# EAGLE design Constant Current Load (EAGLE 6.5.0)
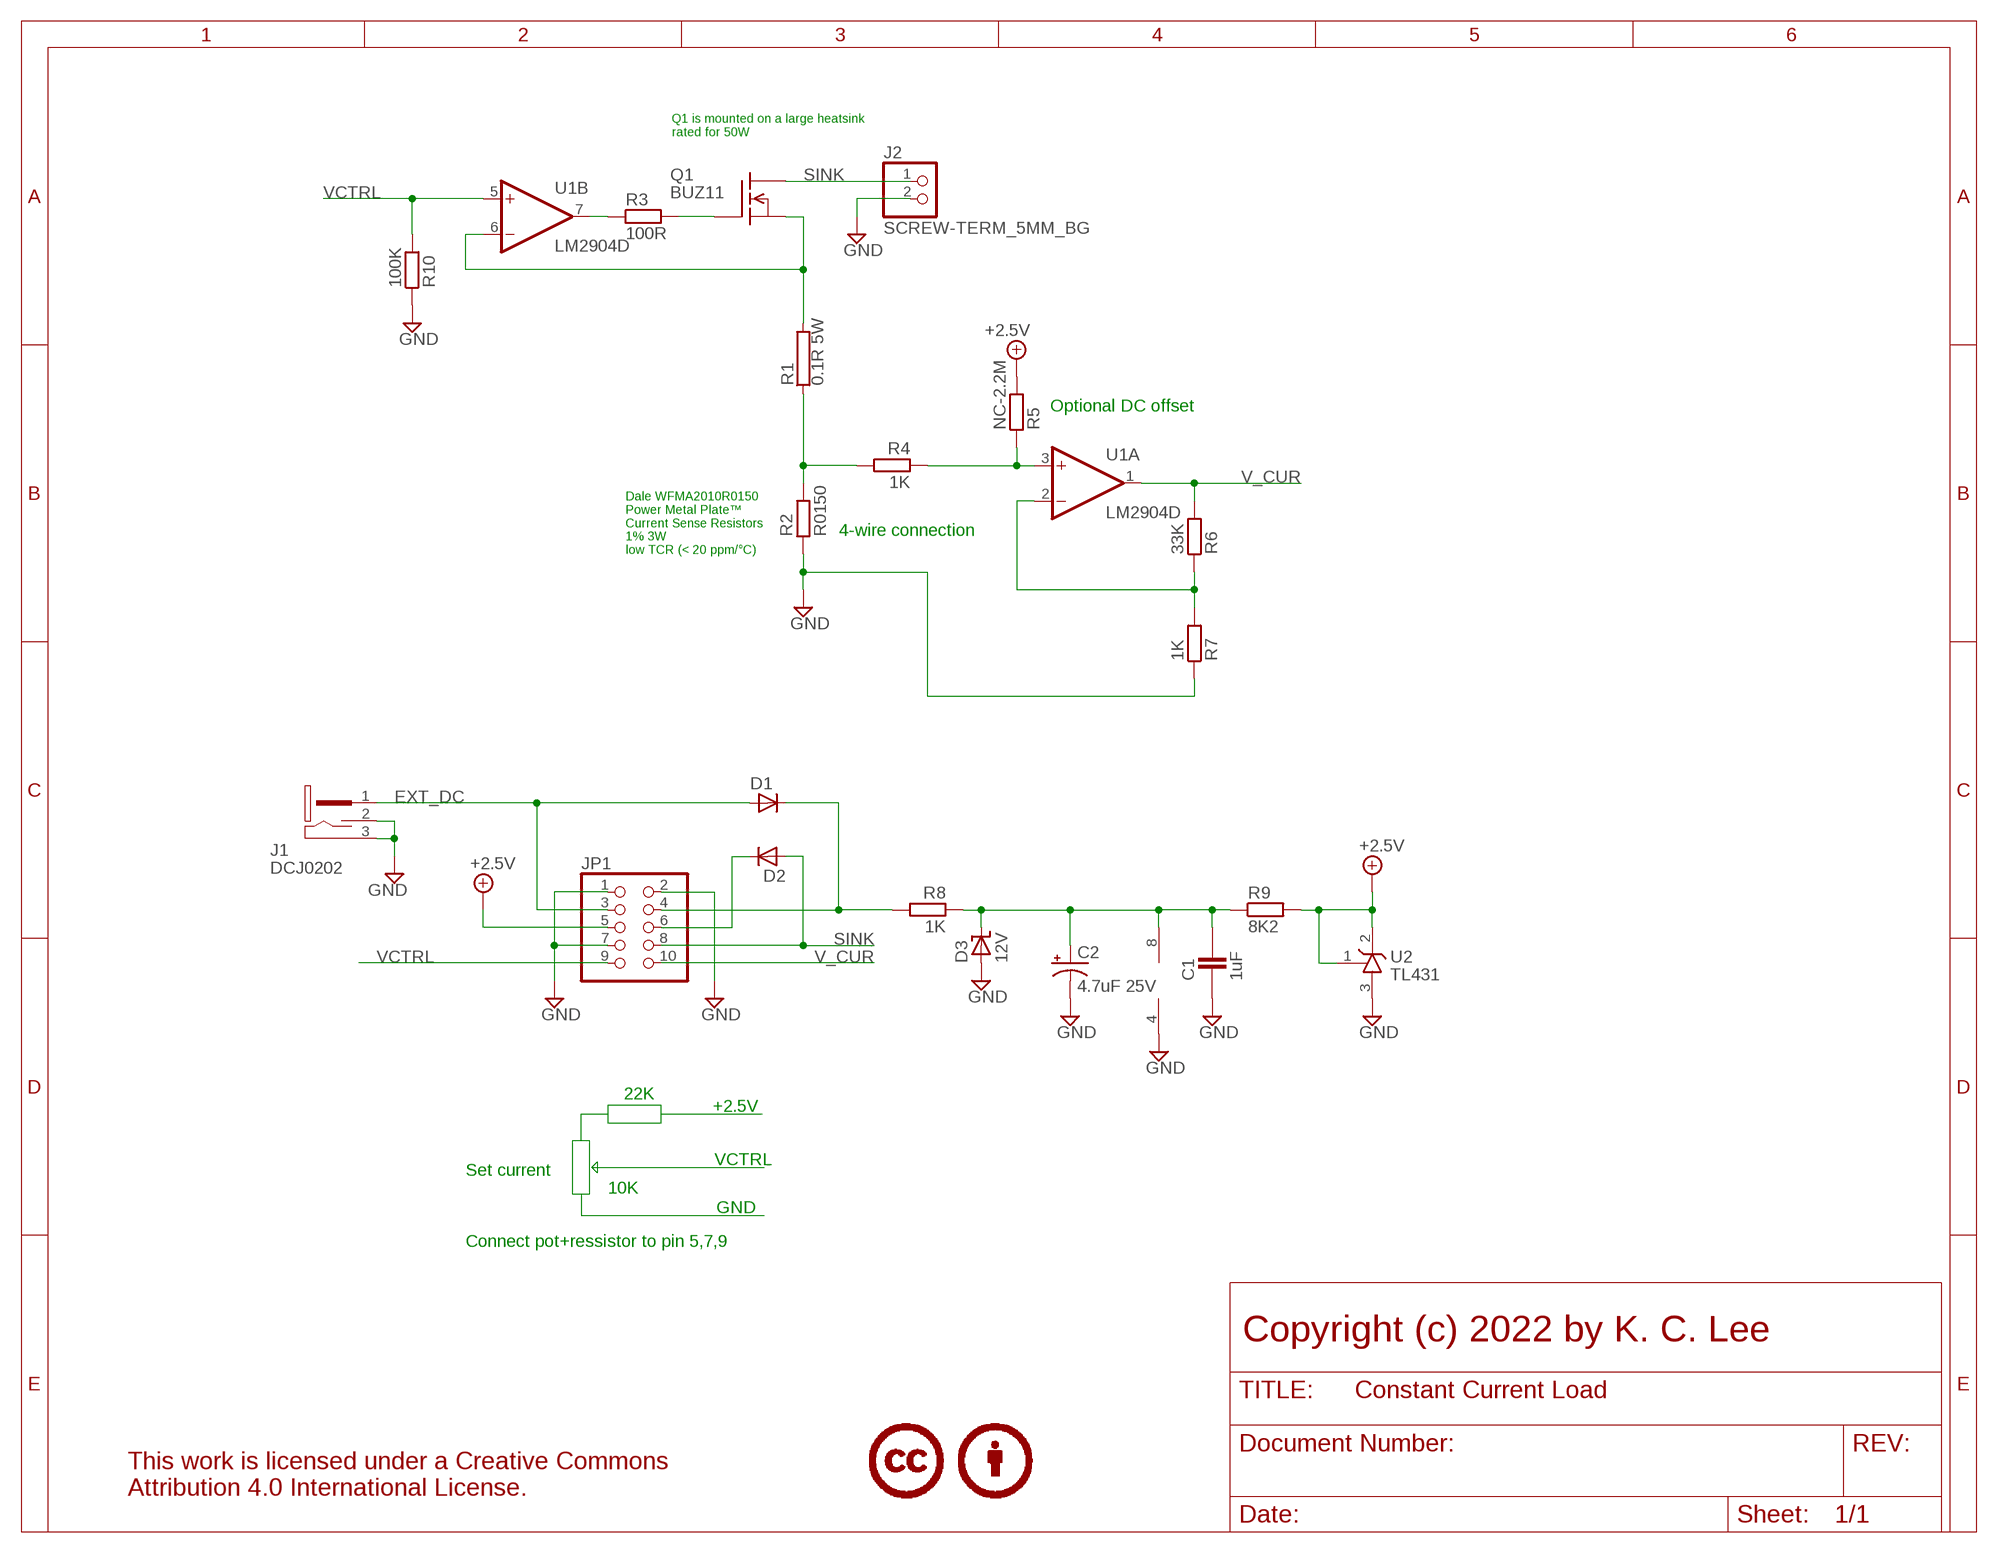
[diagram p0: schematic, sheet 1]

## Parts
C1  1uF  CAPACITOR_0603  [CAPC1608X92N]
C2  4.7uF 25V  CPOL-USE5-6  [E5-6]
D1  DIODE_SOT-23  [SOT95P280X135-3N]
D2  DIODE_SOT-23  [SOT95P280X135-3N]
D3  12V  ZENER_SOT-23  [SOT95P280X135-3N]
J1  DCJ0202  [DCJ0202-SLOTTED]
J2  SCREW-TERM_5MM_BG  [1X02-5MM-BG]
JP1  PINHD-2X5_2.54-W/PLUG  [2X05-W_PLUG]
LICENSE1  CC-BY50%  [CC-BY-50]
Q1  BUZ11  [TO220]
R1  0.1R 5W  RHPS923  [HPS923]
R2  R0150  RESISTOR_2010  [RESC5025X70N]
R3  100R  RESISTOR_0805  [RESC2012X70N]
R4  1K  RESISTOR_0603  [RESC1608X55N]
R5  NC-2.2M  RESISTOR_0603  [RESC1608X55N]
R6  33K  RESISTOR_0603  [RESC1608X55N]
R7  1K  RESISTOR_0603  [RESC1608X55N]
R8  1K  RESISTOR_0805  [RESC2012X70N]
R9  8K2  RESISTOR_0805  [RESC2012X70N]
R10  100K  RESISTOR_0603  [RESC1608X55N]
U1  LM2904D  LM358D  [SO08]
U2  TL431  TL_431DBZ  [SOT95P280X135-3N]

## Nets
+2.5V: JP1.5 R5.2 R9.2 U2.1(R) U2.2(C)
EXT_DC: D1.1(A) J1.1 JP1.3
GND: C1.1 C2.- D3.1(A) J1.2 J1.3 J2.2 JP1.1 JP1.2 JP1.7 R2.1 R7.1 R10.1 U1.4(P:V-) U2.3(A)
N$1: Q1.3(S) R1.2 U1.6(B:-IN)
N$2: C1.2 C2.+ D3.3(K) R8.1 R9.1 U1.8(P:V+)
N$3: D2.3(K) JP1.6
N$4: Q1.1(G) R3.2
N$7: R3.1 U1.7(B:OUT)
N$8: R1.1 R2.2 R4.2
N$9: R4.1 R5.1 U1.3(A:+IN)
N$12: R6.1 R7.2 U1.2(A:-IN)
SINK: D2.1(A) J2.1 JP1.8 Q1.2(D)
V_BUS: D1.3(K) JP1.4 R8.2
V_CUR: JP1.10 R6.2 U1.1(A:OUT)
VCTRL: JP1.9 R10.2 U1.5(B:+IN)

## Notes on the sheet
- Q1 is mounted on a large heatsink
  rated for 50W
- Optional DC offset
- 4-wire connection
- Dale WFMA2010R0150 
  Power Metal Plate™ 
  Current Sense Resistors
  1% 3W 
  low TCR (< 20 ppm/°C)
- 22K
- +2.5V
- VCTRL
- Set current
- 10K
- GND
- Connect pot+ressistor to pin 5,7,9
- Copyright (c) 2022 by K. C. Lee

## Library data of the parts
C1 = ipc-7351-capacitor:CAPACITOR_
C2 = resistor:CPOL-US: POLARIZED CAPACITOR, American symbol
D1 D2 = ipc-7351-diode:DIODE_
D3 = ipc-7351-diode:ZENER_
J1 = Misc Conn:DCJ0202: DC POWER JACK Source: DCJ0202.pdf Pin = CUI Inc. PJ-102A with formed pins
J2 = Misc Conn:SCREW-TERM: Screw Terminal: 3.5mm: On-Shore Technology OSTTE0201x4
JP1 = Misc Conn:PINHD-2X5: PIN HEADER
LICENSE1 = Misc logo:CC-BY
Q1 = transistor-fet:BUZ11: N-Channel Enhancement MOSFET 50V; 30A; 0,040Ohm
R1 = resistor-power:R: Power Resitor; OC_FARNELL: unknown; OC_NEWARK: unknown
R2-R10 = ipc-7351-resistor:RESISTOR_
U1 = linear:LM358: OP AMP also LM158; LM258; LM2904 Source: http://cache.national.com/ds/LM/LM158.pdf
U2 = Misc Analog:TL_431: Voltage Reference 1.24V TI TL431, ST3431

## Board
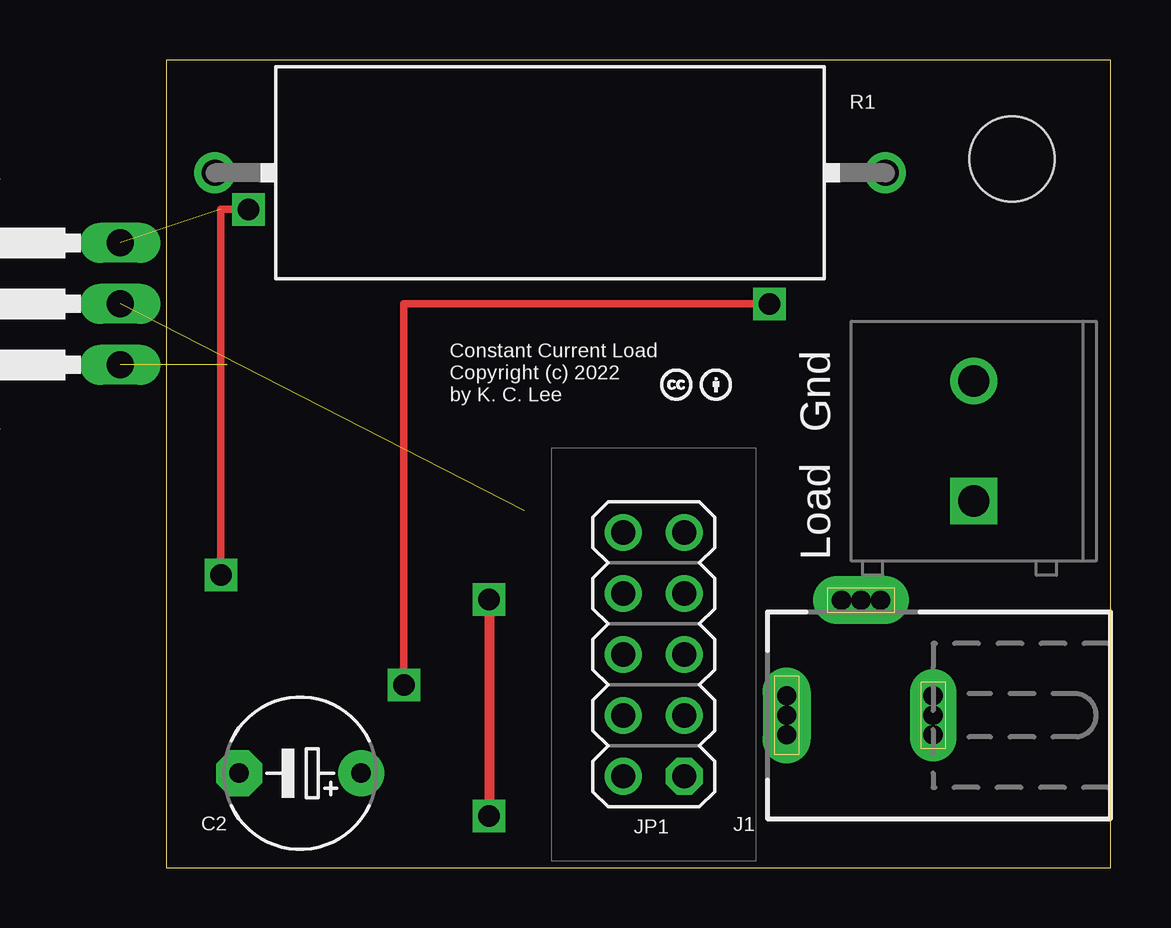
[diagram p1: board, top side]
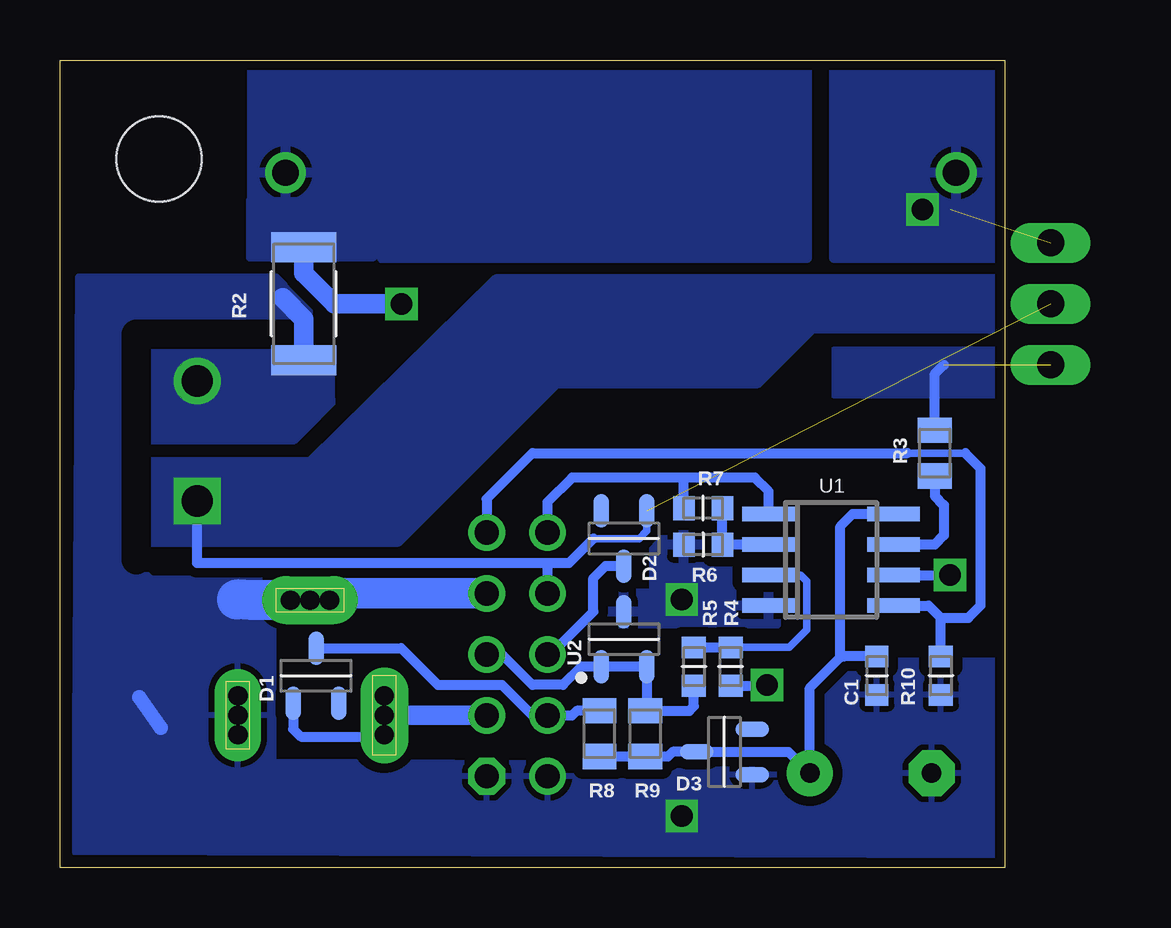
[diagram p2: board, bottom side, seen from below]

Size 39.37 x 33.66 mm. Coordinates in mm from the lower left corner, seen from the top.
Outline: 0,0 39.37,0 39.37,33.66 0,33.66 0,0
Copper layers (1*16): Top 0.035mm / dielectric 1.5mm / Bottom 0.035mm
Design rules "Elecrow 2-layer eagle rule": minimum track width 6mil, minimum drill 12mil, track to track 6mil, track to pad 6mil, pad to pad 6mil, via to via 6mil, smd to smd 0mil, copper to edge 10mil, drill to drill 10mil, minimum pad ring 10mil, minimum via ring 6mil, stop-mask expansion 2mil, vias tented up to drill 100mil, thermal gap 10mil
Holes 3.56 mm at 35.24,29.53
bRestrict: 6 lines

### Footprints (pad centres in the part's own frame; a part is rotated, then mirrored left to right if it is on the bottom)
CAPC1608X92N = smd 0.9 x 0.95: 1 -0.8,0; 2 0.8,0
E5-6 = drill 0.813 pad 1.905: + -2.54,0 | drill 0.813 pad 1.905 octagon: - 2.54,0
SOT95P280X135-3N = smd 1.4 x 0.65: 1 -1.15,0.95; 2 -1.15,-0.95; 3 1.15,0
DCJ0202-SLOTTED = drill 0.8 pad 2 long: 1 0,3.1; 2 4.8,0 | drill 0.8: 1A -0.813,3.1; 1B 0.813,3.1; 2A 4.8,-0.813; 2B 4.8,0.813; 3A -0.813,-3; 3B 0.813,-3 | drill 0.8 pad 1.93 long: 3 0,-3
1X02-5MM-BG = drill 1.3 square: 1 -2.5,0 | drill 1.3: 2 2.5,0
2X05-W_PLUG = drill 1.016 octagon: 1 -5.08,-1.27 | drill 1.016: 2 -5.08,1.27; 3 -2.54,-1.27; 4 -2.54,1.27; 5 0,-1.27; 6 0,1.27; 7 2.54,-1.27; 8 2.54,1.27; 9 5.08,-1.27; 10 5.08,1.27
TO220 = drill 1.118 long: 1 -2.54,-6.35; 2 0,-6.35; 3 2.54,-6.35 | hole 3.302: 0,11.176
HPS923 = drill 1.1 pad 1.7: 1 -13.97,0; 2 13.97,0
RESC5025X70N = smd 1.25 x 2.7: 1 -2.35,0; 2 2.35,0
RESC2012X70N = smd 1.05 x 1.4: 1 -0.95,0; 2 0.95,0
RESC1608X55N = smd 0.9 x 1: 1 -0.8,0; 2 0.8,0
SO08 = smd 0.6 x 2.2: 1 -1.905,-2.6; 2 -0.635,-2.6; 3 0.635,-2.6; 4 1.905,-2.6; 5 1.905,2.6; 6 0.635,2.6; 7 -0.635,2.6; 8 -1.905,2.6

### Placement (x,y rotation side)
C1  5.33,8 90 bottom
C2  5.59,3.94 180 top
D1  28.7,8 90 bottom
D2  15.88,13.72 270 bottom
D3  11.68,4.83 180 bottom
J1  28.96,6.35 90 top
J2  33.66,17.78 90 top
JP1  20.32,8.89 90 top
LICENSE1  20.57,19.43 0 top
Q1  -8.26,23.5 90 top
R1  16,28.96 180 top
R2  29.21,23.5 90 bottom
R3  2.92,17.27 90 bottom
R4  11.43,8.38 270 bottom
R5  12.95,8.38 270 bottom
R6  12.57,14.99 180 bottom
R7  12.57,13.46 0 bottom
R8  16.89,5.59 90 bottom
R9  14.99,5.59 90 bottom
R10  2.67,8 90 bottom
U1  7.24,12.83 270 bottom
U2  15.88,9.53 90 bottom

### Tracks (layer width: path | path; a pad name or v marks a point on that pad's centre or on a via)
+2.5V
  Bottom 0.406: JP1.5 20.95,8.89 19.68,7.62 18.41,7.62 17.66,8.38 U2.1 U2.2 14.93,6.6 R9.2 13.15,6.54 12.95,6.73 R5.2
EXT_DC
  Bottom 0.406: J1.1 25.86,5.46 29.34,5.46 29.65,5.78 D1.1
  Bottom 0.813: JP1.3 J1.1
GND  (via drill 0.9)
  Top 0.406: v13.46,11.18 v13.46,2.16
  Bottom 0.406: 15.87,10.67 U2.3
  Bottom 0.61: 36.07,7.11 35.18,5.84 | J1.2 28.86,11.15 28.57,11.43
  Bottom 0.813: R2.1 29.21,22.86 30.1,23.75
  Bottom 1.27: JP1.7 28.57,11.43
  Bottom 1.676: J1.2 31.39,11.15 32,11.18 | 32,7.06 J1.3
  pour Bottom (isolate 0.406): 38.61,24.64 30.35,24.64 28.96,23.24 28.96,22.23 35.56,22.23 36.2,21.59 36.2,12.7 35.56,12.06 30.48,12.06 30.48,4.45 7.87,4.32 7.87,4.83 8,8.64 0.25,8.64 0.25,0.51 38.73,0.64 38.73,5.71
  pour Bottom (isolate 0.406, no thermals): 27.56,21.59 30.73,21.59 30.99,21.84 35.69,21.84 35.69,17.78 29.59,17.78 27.56,19.81
  pour Bottom (isolate 0.406): 9.53,13.97 9.53,10.16 16.51,10.16 16.51,11.43 14.61,11.43 14.61,13.34 13.97,13.97
N$1  (via drill 0.9)  (1 unrouted)
  Top 0.305: v2.29,12.19 2.29,27.43 v3.43,27.43
  Bottom 0.406: U1.6 v2.29,12.19
  pour Bottom (isolate 0.406): 0,25.4 7.11,25.4 7.11,33.66 0,33.66
N$2
  Bottom 0.406: R8.1 R9.1 14.03,4.64 13.84,4.83 D3.3 9.02,4.83 C2.+ 8.13,7.49 6.86,8.76 | U1.8 6.35,14.73 6.86,14.22 6.86,8.76 | C1.2 6.69,8.8 6.86,8.76
N$3
  Bottom 0.406: JP1.6 18.92,8.89 17.14,10.67 17.14,12.06 16.64,12.57 D2.3
N$4  (1 unrouted)
  Bottom 0.406: R3.2 2.92,20.57 2.54,20.95
  pour Bottom (isolate 0.406): -0.13,21.59 7.11,21.59 7.11,19.68 -0.13,19.68
N$7
  Bottom 0.406: R3.1 2.92,15.49 2.54,15.11 2.54,13.84 2.92,13.46 U1.7
N$8  (via drill 0.9)
  Top 0.305: v25.15,23.5 9.91,23.5 v9.91,7.62
  Bottom 0.406: R4.2 9.87,7.58 v9.91,7.62
  Bottom 0.813: v25.15,23.5 27.94,23.5 29.21,24.77 R2.2
  pour Bottom (isolate 0.406, rank 2): 8.26,33.66 8.26,25.4 26.16,25.4 26.92,26.16 27.05,26.16 27.05,27.56 31.37,27.56 31.37,33.66
  pour Bottom (rank 2, no thermals): 26.29,25.4 26.29,27.81 31.5,27.81 31.5,25.4
N$9
  Bottom 0.305: U1.3 8.51,12.19 8.26,11.94 8.26,9.91 8.98,9.18 R4.1
  Bottom 0.406: R5.1 R4.1
N$12
  Bottom 0.406: U1.2 R7.2 R6.1
SINK  (1 unrouted)
  Bottom 0.305: 17.14,13.72 15.24,13.72 14.93,14.03 D2.1
  Bottom 0.406: 33.66,15.24 33.66,12.7 19.05,12.7 | JP1.8 19.05,12.7 | 19.05,12.7 18.16,12.7 17.14,13.72
  pour Bottom (isolate 0.406, rank 2, no thermals): 0,24.51 21.21,24.51 28.96,16.89 35.56,16.89 35.56,13.59 25.27,13.59 18.67,20.19 10.29,20.19 8,22.48 0,22.48
V_BUS
  Bottom 0.406: D1.3 25.15,9.15 23.62,7.62 20.95,7.62 19.68,6.35 JP1.4 18.03,6.35 17.85,6.54 R8.2
V_CUR
  Bottom 0.406: JP1.10 19.05,15.24 18.03,16.26 13.34,16.26 | 13.34,16.26 10.41,16.26 9.84,15.68 U1.1 | R6.2 13.37,16.22 13.34,16.26
VCTRL
  Bottom 0.305: 4.06,17.27 1.65,17.27
  Bottom 0.406: JP1.9 21.59,15.37 19.68,17.27 4.06,17.27 | 1.65,17.27 1.02,16.64 1.02,10.92 1.52,10.41 2.67,10.41 | U1.5 3.17,10.92 2.67,10.41 | R10.2 2.67,10.41

### Text on the board
tPlace: Constant Current Load / Copyright (c) 2022 / by K. C. Lee | Gnd | Load